# Altium schematic sheet connector-top-j3-0.SchDoc: Connector - J3(Top) 0
size Letter; CompanyName: Brinton Engineering, LLC; Address1: 3479 Edison Way; Address2: Menlo Park CA 94025; Address3: +1 (877) 778-8435; Address4: brintonengineering.com; Revision: 1; SheetNumber: 1; SheetTotal: 1
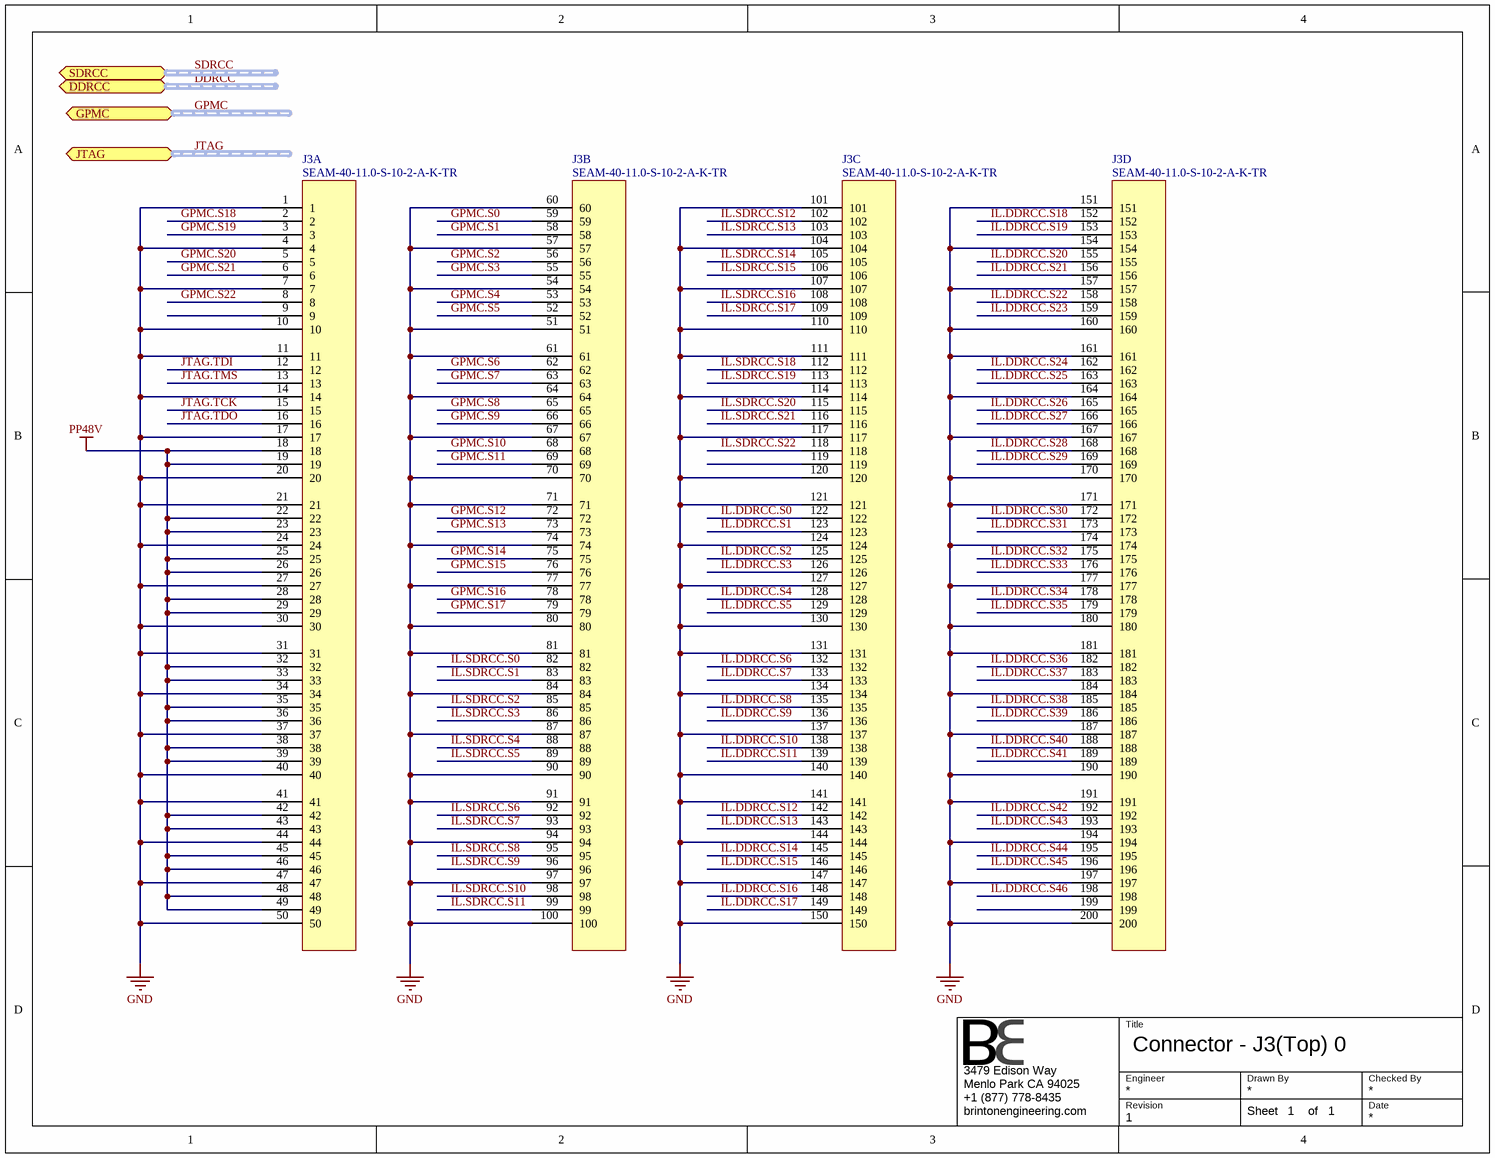
[diagram p0: connector-top-j3-0.SchDoc]

## Parts
J3  SEAM-40-11.0-S-10-2-A-K-TR  [SEAM-40-11.0-S-10-2-A-K-TR]  (parts A,B,C,D of 8)

## Ports
DDRCC (harness INTERLINK), GPMC (harness GPMC), JTAG (harness JTAG), SDRCC (harness INTERLINK)

## Nets
GND: J3.1 J3.4 J3.7 J3.10 J3.11 J3.14 J3.17 J3.20 J3.21 J3.24 J3.27 J3.30 J3.31 J3.34 J3.37 J3.40 J3.41 J3.44 J3.47 J3.50 J3.51 J3.54 J3.57 J3.60 J3.61 J3.64 J3.67 J3.70 J3.71 J3.74 J3.77 J3.80 J3.81 J3.84 J3.87 J3.90 J3.91 J3.94 J3.97 J3.100 J3.101 J3.104 J3.107 J3.110 J3.111 J3.114 J3.117 J3.120 J3.121 J3.124 J3.127 J3.130 J3.131 J3.134 J3.137 J3.140 J3.141 J3.144 J3.147 J3.150 J3.151 J3.154 J3.157 J3.160 J3.161 J3.164 J3.167 J3.170 J3.171 J3.174 J3.177 J3.180 J3.181 J3.184 J3.187 J3.190 J3.191 J3.194 J3.197 J3.200
PP48V: J3.18 J3.19 J3.22 J3.23 J3.25 J3.26 J3.28 J3.29 J3.32 J3.33 J3.35 J3.36 J3.38 J3.39 J3.42 J3.43 J3.45 J3.46 J3.48 J3.49
GPMC.S0: J3.59
GPMC.S1: J3.58
GPMC.S2: J3.56
GPMC.S3: J3.55
GPMC.S4: J3.53
GPMC.S5: J3.52
GPMC.S6: J3.62
GPMC.S7: J3.63
GPMC.S8: J3.65
GPMC.S9: J3.66
GPMC.S10: J3.68
GPMC.S11: J3.69
GPMC.S12: J3.72
GPMC.S13: J3.73
GPMC.S14: J3.75
GPMC.S15: J3.76
GPMC.S16: J3.78
GPMC.S17: J3.79
GPMC.S18: J3.2
GPMC.S19: J3.3
GPMC.S20: J3.5
GPMC.S21: J3.6
GPMC.S22: J3.8
IL.DDRCC.S0: J3.122
IL.DDRCC.S1: J3.123
IL.DDRCC.S2: J3.125
IL.DDRCC.S3: J3.126
IL.DDRCC.S4: J3.128
IL.DDRCC.S5: J3.129
IL.DDRCC.S6: J3.132
IL.DDRCC.S7: J3.133
IL.DDRCC.S8: J3.135
IL.DDRCC.S9: J3.136
IL.DDRCC.S10: J3.138
IL.DDRCC.S11: J3.139
IL.DDRCC.S12: J3.142
IL.DDRCC.S13: J3.143
IL.DDRCC.S14: J3.145
IL.DDRCC.S15: J3.146
IL.DDRCC.S16: J3.148
IL.DDRCC.S17: J3.149
IL.DDRCC.S18: J3.152
IL.DDRCC.S19: J3.153
IL.DDRCC.S20: J3.155
IL.DDRCC.S21: J3.156
IL.DDRCC.S22: J3.158
IL.DDRCC.S23: J3.159
IL.DDRCC.S24: J3.162
IL.DDRCC.S25: J3.163
IL.DDRCC.S26: J3.165
IL.DDRCC.S27: J3.166
IL.DDRCC.S28: J3.168
IL.DDRCC.S29: J3.169
IL.DDRCC.S30: J3.172
IL.DDRCC.S31: J3.173
IL.DDRCC.S32: J3.175
IL.DDRCC.S33: J3.176
IL.DDRCC.S34: J3.178
IL.DDRCC.S35: J3.179
IL.DDRCC.S36: J3.182
IL.DDRCC.S37: J3.183
IL.DDRCC.S38: J3.185
IL.DDRCC.S39: J3.186
IL.DDRCC.S40: J3.188
IL.DDRCC.S41: J3.189
IL.DDRCC.S42: J3.192
IL.DDRCC.S43: J3.193
IL.DDRCC.S44: J3.195
IL.DDRCC.S45: J3.196
IL.DDRCC.S46: J3.198
IL.SDRCC.S0: J3.82
IL.SDRCC.S1: J3.83
IL.SDRCC.S2: J3.85
IL.SDRCC.S3: J3.86
IL.SDRCC.S4: J3.88
IL.SDRCC.S5: J3.89
IL.SDRCC.S6: J3.92
IL.SDRCC.S7: J3.93
IL.SDRCC.S8: J3.95
IL.SDRCC.S9: J3.96
IL.SDRCC.S10: J3.98
IL.SDRCC.S11: J3.99
IL.SDRCC.S12: J3.102
IL.SDRCC.S13: J3.103
IL.SDRCC.S14: J3.105
IL.SDRCC.S15: J3.106
IL.SDRCC.S16: J3.108
IL.SDRCC.S17: J3.109
IL.SDRCC.S18: J3.112
IL.SDRCC.S19: J3.113
IL.SDRCC.S20: J3.115
IL.SDRCC.S21: J3.116
IL.SDRCC.S22: J3.118
JTAG.TCK: J3.15
JTAG.TDI: J3.12
JTAG.TDO: J3.16
JTAG.TMS: J3.13

Not connected (* = marked no-connect by the designer): J3 9 119 199

## Buses and harness runs
harness DDRCC = port DDRCC
harness GPMC = port GPMC
harness JTAG = port JTAG
harness SDRCC = port SDRCC

## Notes on the sheet
- Title
- Engineer
- Revision
- Drawn By
- Checked By
- Date
- Sheet
- of

## Library data of the parts
J3 = SEAM-40-11.0-S-10-2-A-K-TR: Terminal Array Assembly, Surface Mount, 0.050" Pitch, 400 Pins; Manufacturer: Samtec; Manufacturer P/N: SEAM-40-11.0-S-10-2-A-K-TR